# EAGLE schematic main_pcb (EAGLE 9.0.0)
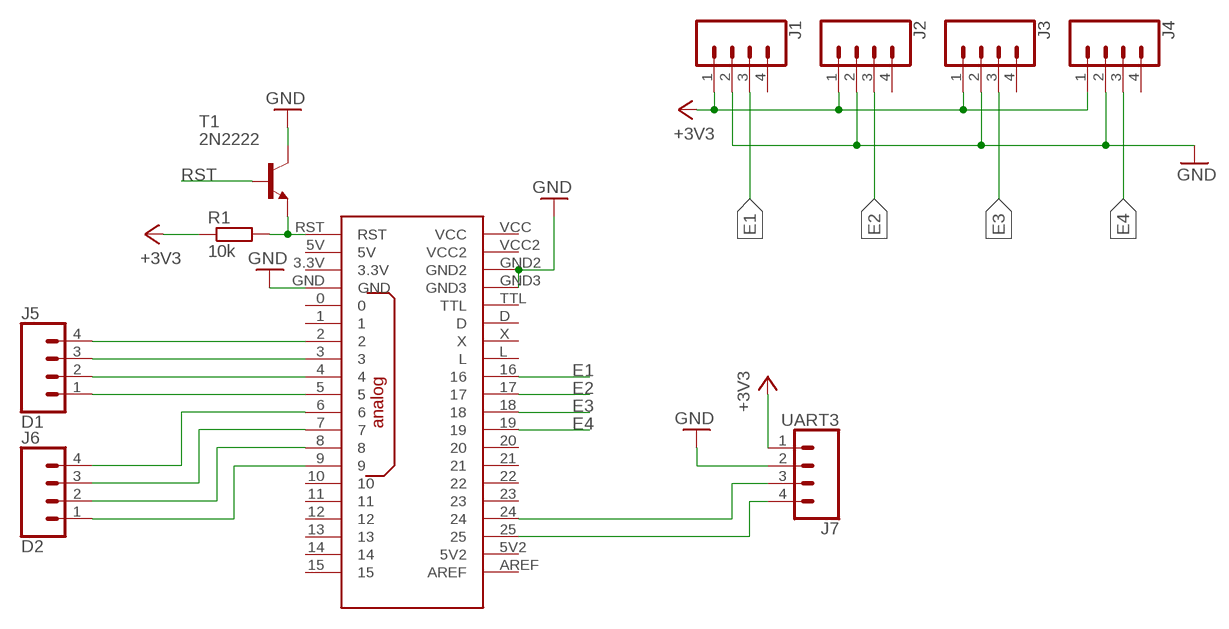
[diagram p0: schematic, sheet 1]

## Parts
J1  CONN_04JST-PTH  [JST-4-PTH]
J2  CONN_04JST-PTH  [JST-4-PTH]
J3  CONN_04JST-PTH  [JST-4-PTH]
J4  CONN_04JST-PTH  [JST-4-PTH]
J5  D1  CONN_04JST-PTH  [JST-4-PTH]
J6  D2  CONN_04JST-PTH  [JST-4-PTH]
J7  UART3  CONN_04  [1X04]
R1  10k  R-EU_0204/7  [0204/7]
T1  2N2222  [TO18]
U$1  OPENCM9.04  [OPENCM9.04]

## Nets
+3V3: J1.1 J2.1 J3.1 J4.1 J7.1 R1.1
E1: J1.3 U$1.16
E2: J2.3 U$1.17
E3: J3.3 U$1.18
E4: J4.3 U$1.19
GND: J1.2 J2.2 J3.2 J4.2 J7.2 T1.3(C) U$1.GND U$1.GND2 U$1.GND3
N$1: R1.2 T1.1(E) U$1.RST
N$2: J5.1 U$1.5
N$3: J5.2 U$1.4
N$4: J5.3 U$1.3
N$5: J5.4 U$1.2
N$6: J6.4 U$1.6
N$7: J6.3 U$1.7
N$8: J6.2 U$1.8
N$9: J6.1 U$1.9
N$10: J7.4 U$1.25
N$11: J7.3 U$1.24
RST: T1.2(B)
Unconnected: J1.4 J2.4 J3.4 J4.4 U$1.0 U$1.1 U$1.3.3V U$1.5V U$1.5V2 U$1.10 U$1.11 U$1.12 U$1.13 U$1.14 U$1.15 U$1.20 U$1.21 U$1.22 U$1.23 U$1.AREF U$1.D U$1.L U$1.TTL U$1.VCC U$1.VCC2 U$1.X

## Library data of the parts
J1-J6 = SparkFun-Connectors:CONN_04: Multi connection point. Often used as Generic Header-pin footprint for 0.1 inch spaced/style header connections On any of the 0.1 inch spaced packages, you can populate with these: Break Away Headers - Straight <https://www.sparkfun.com/products/116> (PRT-00116) Break Away Male Headers - Right Angle <https://www.sparkfun.com/products/553> (PRT-00553) Female Headers <https://www.sparkfun.com/products/115> (PRT-00115) Break Away Headers - Machine Pin <https://www.sparkfun.com/products/117> (PRT-00117) Break Away Female Headers - Swiss Machine Pin <https://www.sparkfun.com/products/743> (PRT-00743) For SCREWTERMINALS and SPRING TERMINALS visit here: Screw Terimnals on SparkFun.com <https://www.sparkfun.com/search/results?term=Screw+Terminals> (5mm/3.5mm/2.54mm spacing) This device is also useful as a general connection point to wire up your design to another part of your project. Our various solder wires solder well into these plated through hole pads. Hook-Up Wire - Assortment (Stranded, 22 AWG) <https://www.sparkfun.com/products/11375> (PRT-11375) Hook-Up Wire - Assortment (Solid Core, 22 AWG) <https://www.sparkfun.com/products/11367> (PRT-11367) View the entire wire category on our website here <https://www.sparkfun.com/categories/141> Special notes: Molex polarized connector foot print use with SKU : PRT-08231 with associated crimp pins and housings. 1MM SMD Version SKU: PRT-10208; PROD_ID: WIRE-13531; SF_ID: PRT-09916
J7 = SparkFun-Connectors:CONN_04: Multi connection point. Often used as Generic Header-pin footprint for 0.1 inch spaced/style header connections On any of the 0.1 inch spaced packages, you can populate with these: Break Away Headers - Straight <https://www.sparkfun.com/products/116> (PRT-00116) Break Away Male Headers - Right Angle <https://www.sparkfun.com/products/553> (PRT-00553) Female Headers <https://www.sparkfun.com/products/115> (PRT-00115) Break Away Headers - Machine Pin <https://www.sparkfun.com/products/117> (PRT-00117) Break Away Female Headers - Swiss Machine Pin <https://www.sparkfun.com/products/743> (PRT-00743) For SCREWTERMINALS and SPRING TERMINALS visit here: Screw Terimnals on SparkFun.com <https://www.sparkfun.com/search/results?term=Screw+Terminals> (5mm/3.5mm/2.54mm spacing) This device is also useful as a general connection point to wire up your design to another part of your project. Our various solder wires solder well into these plated through hole pads. Hook-Up Wire - Assortment (Stranded, 22 AWG) <https://www.sparkfun.com/products/11375> (PRT-11375) Hook-Up Wire - Assortment (Solid Core, 22 AWG) <https://www.sparkfun.com/products/11367> (PRT-11367) View the entire wire category on our website here <https://www.sparkfun.com/categories/141> Special notes: Molex polarized connector foot print use with SKU : PRT-08231 with associated crimp pins and housings. 1MM SMD Version SKU: PRT-10208; PROD_ID: CONN-09696
R1 = resistor:R-EU_: RESISTOR, European symbol
T1 = transistor:2N2222: NPN TRANSISTOR
U$1 = OpenCM9.04:OPENCM9.04